# Altium schematic sheet Esquemático_TP1_ASSD_2.SchDoc
size A4; SheetNumber: 2; SheetTotal: 2
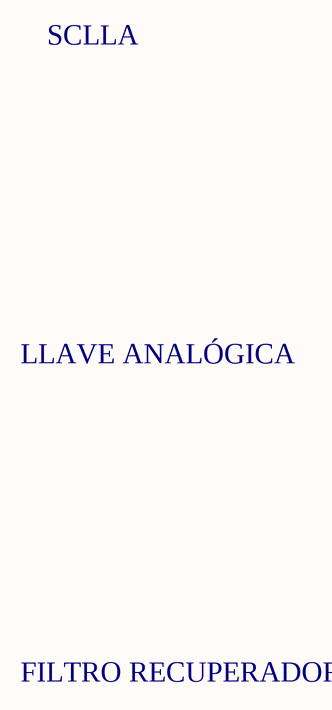
[diagram p0: Esquemático_TP1_ASSD_2.SchDoc]

## Notes on the sheet
- SCLLA
- LLAVE ANALÓGICA
- FILTRO RECUPERADOR